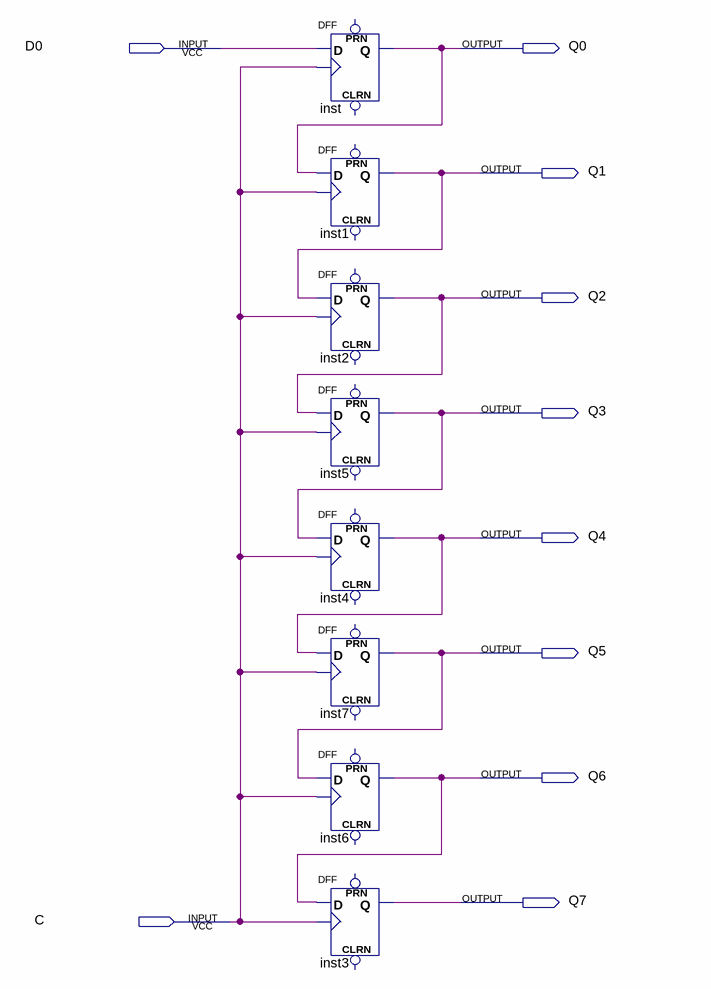
[diagram p0: schematic sheet]
// Quartus schematic lab1.bdf as structural Verilog: 8 symbols, 10 pins
module lab1 (
  input  D0,
  input  C,
  output Q0,
  output Q1,
  output Q2,
  output Q3,
  output Q4,
  output Q5,
  output Q6,
  output Q7
);

  DFF inst (.CLK(C), .D(D0), .Q(Q0));  // open: CLRN, PRN
  DFF inst1 (.CLK(C), .D(Q0), .Q(Q1));  // open: CLRN, PRN
  DFF inst2 (.CLK(C), .D(Q1), .Q(Q2));  // open: CLRN, PRN
  DFF inst5 (.CLK(C), .D(Q2), .Q(Q3));  // open: CLRN, PRN
  DFF inst4 (.CLK(C), .D(Q3), .Q(Q4));  // open: CLRN, PRN
  DFF inst7 (.CLK(C), .D(Q4), .Q(Q5));  // open: CLRN, PRN
  DFF inst6 (.CLK(C), .D(Q5), .Q(Q6));  // open: CLRN, PRN
  DFF inst3 (.CLK(C), .D(Q6), .Q(Q7));  // open: CLRN, PRN
endmodule
